# Altium schematic sheet 06_Memory.SchDoc
size A4; SheetNumber: 6; SheetTotal: 6
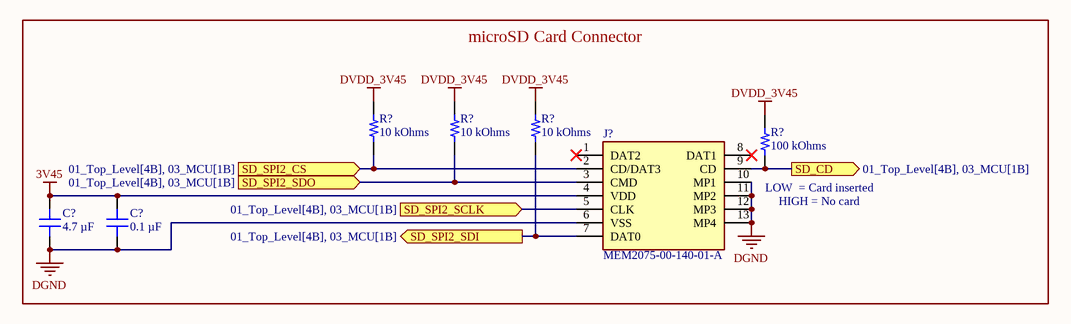
[diagram p0: 06_Memory.SchDoc]

## Parts
(Parts that share a designator on the sheet are numbered #1, #2 ... from top to bottom, then left to right.)
C?#1  4.7 µF  [CAP 0805_2012]
C?#2  0.1 µF  [CAP 0402_1005]
J?  MEM2075-00-140-01-A  [MEM20750014001A]
R?#1  10 kOhms  [RES 0402_1005]
R?#2  10 kOhms  [RES 0402_1005]
R?#3  10 kOhms  [RES 0402_1005]
R?#4  100 kOhms  [RES 0402_1005]

## Ports
SD_CD (out, see 01_Top_Level[4B], 03_MCU[1B]), SD_SPI2_CS (in, see 01_Top_Level[4B], 03_MCU[1B]), SD_SPI2_SCLK (in, see 01_Top_Level[4B], 03_MCU[1B]), SD_SPI2_SDI (out, see 01_Top_Level[4B], 03_MCU[1B]), SD_SPI2_SDO (in, see 01_Top_Level[4B], 03_MCU[1B])

## Nets
3V45: C?#1.2 C?#2.1 J?.4(VDD)
DGND: C?#1.1 C?#2.2 J?.6(VSS) J?.10(MP1) J?.11(MP2) J?.12(MP3) J?.13(MP4)
DVDD_3V45: R?#1.2 R?#2.2 R?#3.2 R?#4.2
SD_CD: J?.9(CD) R?#4.1 ; port SD_CD
SD_SPI2_CS: J?.2(CD/DAT3) R?#1.1 ; port SD_SPI2_CS
SD_SPI2_SCLK: J?.5(CLK) ; port SD_SPI2_SCLK
SD_SPI2_SDI: J?.7(DAT0) R?#3.1 ; port SD_SPI2_SDI
SD_SPI2_SDO: J?.3(CMD) R?#2.1 ; port SD_SPI2_SDO

Not connected (* = marked no-connect by the designer): J? 1(DAT2)* 8(DAT1)*

## Notes on the sheet
- microSD Card Connector
- LOW  = Card inserted
- HIGH = No card

## Library data of the parts
C?#1 = MSAST21GAB5475KTNA01: CAP CER 4.7UF 25V X5R 0805; manufacturer: Taiyo Yuden; Tolerance: ±10%; Part Number: MSAST21GAB5475KTNA01; Capacitance: 4.7 µF; Applications: SMPS Filtering; componentlink1description: Datasheet; componentlink1url: https://mm.digikey.com/Volume0/opasdata/d220001/medias/docus/5731/MSR01_e.pdf; componentlink2description: DigiKey Link; componentlink2url: https://www.digikey.com/en/products/detail/taiyo-yuden/MSAST21GAB5475KTNA01/16659772; Device Package: 0805 (2012 Metric); lastupdated: 4/6/2026 7:29:35 PM; Lifecycle Status: Active; Minimum Order: 1; Mounting Type: Surface Mount, MLCC; Operating Temperature: -55°C ~ 85°C; Package / Case: 0805 (2012 Metric); packaging: TapeAndReel; partid: 73602; price: 0.02; series: MSAS; Size / Dimension: 0.079" L x 0.049" W (2.00mm x 1.25mm); Supplier 1: DigiKey; Supplier Part Number 1: 587-MSAST21GAB5475KTNA01CT-ND; Temperature Coefficient: X5R; Thickness (Max): 0.055" (1.40mm); value: 4.7 µF; Voltage - Rated: 25V
C?#2 = EMF105B7104KVHF: CAP CER 0.1UF 16V X7R 0402; manufacturer: Taiyo Yuden; Tolerance: ±10%; Part Number: EMF105B7104KVHF; Capacitance: 0.1 µF; Applications: Automotive, SMPS Filtering; componentlink1description: Datasheet; componentlink1url: https://ds.yuden.co.jp/TYCOMPAS/ut/detail?pn=EMF105B7104KVHF&u=M; componentlink2description: DigiKey Link; componentlink2url: https://www.digikey.com/en/products/detail/taiyo-yuden/EMF105B7104KVHF/10379129; Device Package: 0402 (1005 Metric); lastupdated: 4/6/2026 7:11:11 PM; Lifecycle Status: Active; Minimum Order: 1; Mounting Type: Surface Mount, MLCC; Operating Temperature: -55°C ~ 125°C; Package / Case: 0402 (1005 Metric); packaging: TapeAndReel; partid: 1868; Part Status: Active; price: 0.01; Ratings: AEC-Q200; series: M; Size / Dimension: 0.039" L x 0.020" W (1.00mm x 0.50mm); Supplier 1: DigiKey; Supplier Part Number 1: 587-6563-1-ND; Temperature Coefficient: X7R; Thickness (Max): 0.022" (0.55mm); value: 0.1 µF; Voltage - Rated: 16V
J? = MEM2075-00-140-01-A: Connector; Manufacturer_Name: GCT (GLOBAL CONNECTOR TECHNOLOGY); Datasheet Link: http://www.farnell.com/cad/2606866.pdf; Height: 1.45mm; Manufacturer_Part_Number: MEM2075-00-140-01-A; Mouser Part Number: 640-MEM20750014001A; Mouser Price/Stock: https://www.mouser.co.uk/ProductDetail/GCT/MEM2075-00-140-01-A?qs=KUoIvG%2F9IlZvfWpeERlq3Q%3D%3D; DigiKey Link: https://www.digikey.ca/en/products/detail/gct/MEM2075-00-140-01-A/9859614
R?#1-R?#3 = CRCW040210K0FKEE: RES SMD 10K OHM 1% 1/16W 0402; Manufacturer: Vishay Dale; Power (Watts): 0.063W, 1/16W; Temperature Coefficient: ±100ppm/°C; Part Number: CRCW040210K0FKEE; Value: 10 kOhms; ComponentLink1Description: Datasheet; ComponentLink1URL: http://www.vishay.com/docs/20035/dcrcwe3.pdf; ComponentLink2Description: DigiKey Link; ComponentLink2URL: https://www.digikey.com/en/products/detail/vishay-dale/CRCW040210K0FKEE/5069897; Composition: Thick Film; Device Package: 0402 (1005 Metric); Features: Automotive AEC-Q200; Height - Seated (Max): 0.016" (0.40mm); LastUpdated: 2/9/2024 8:30:20 PM; Lifecycle Status: Active; Minimum Order: 1; Number of Terminations: 2; Operating Temperature: -55°C ~ 155°C; Package / Case: 0402 (1005 Metric); Packaging: CutTape; PartId: 3471; Part Status: Active; Price: 0.01; Ratings: AEC-Q200; Resistance: 10 kOhms; Series: CRCW; Size / Dimension: 0.039" L x 0.020" W (1.00mm x 0.50mm); Supplier 1: DigiKey; Supplier Part Number 1: 541-2954-1-ND; Supplier Device Package: 0402; Tolerance: ±1%
R?#4 = RT0402FRE07100KL: RES SMD 100K OHM 1% 1/16W 0402; Manufacturer: Yageo; Power (Watts): 0.063W, 1/16W; Temperature Coefficient: ±50ppm/°C; Part Number: RT0402FRE07100KL; Value: 100 kOhms; ComponentLink1Description: Datasheet; ComponentLink1URL: https://www.yageo.com/upload/media/product/productsearch/datasheet/rchip/PYu-RT_1-to-0.01_RoHS_L_11.pdf; ComponentLink2Description: DigiKey Link; ComponentLink2URL: https://www.digikey.com/en/products/detail/yageo/RT0402FRE07100KL/1071698; Composition: Thin Film; Device Package: 0402 (1005 Metric); Height - Seated (Max): 0.014" (0.35mm); LastUpdated: 4/6/2026 7:41:17 PM; Lifecycle Status: Active; Minimum Order: 1; Number of Terminations: 2; Operating Temperature: -55°C ~ 155°C; Package / Case: 0402 (1005 Metric); Packaging: TapeAndReel; PartId: 3190; Part Status: Active; Price: 0.01; Resistance: 100 kOhms; Series: RT; Size / Dimension: 0.039" L x 0.020" W (1.00mm x 0.50mm); Supplier 1: DigiKey; Supplier Part Number 1: YAG2307CT-ND; Supplier Device Package: 0402; Tolerance: ±1%